# EAGLE schematic Communication_Plug_USB_Micro_B_FCI_10103594-0001LF (EAGLE 6.5.0)
Micro B USB receptacle: FCI 10103594-0001LF Datasheet <http://portal.fciconnect.com/Comergent//fci/drawing/10103594.pdf> Through hole As per USB spec, the capacitance across the USB power lines must be between 1µf and 10µf. Use 5V_USB service and a load limiter like the FPF2123 if your board does not meet this specification or if you are unsure.
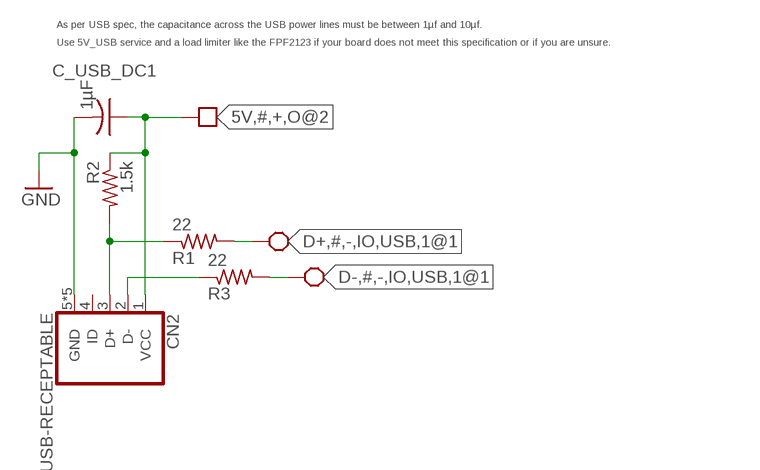
[diagram p0: schematic, sheet 1]

## Parts
C_USB_DC1  1µF  C-USC0603  [C0603]
CN2  USB-RECEPTABLE  [FCI-10103594-0001LF]
R1  22  R-US_R0603  [R0603]
R2  1.5k  R-US_R0603  [R0603]
R3  22  R-US_R0603  [R0603]

## Nets
5V,#,+,O@2: C_USB_DC1.1 CN2.1(VCC) R2.1 ; supply symbol labelled BLOCK_OPTIONAL
D+,#,-,IO,USB,1@1: R1.2 ; supply symbol labelled BLOCK_REQUIREMENT
D+_IN_1: CN2.3(D+) R1.1 R2.2
D-,#,-,IO,USB,1@1: R3.2 ; supply symbol labelled BLOCK_REQUIREMENT
D-_IN_1: CN2.2(D-) R3.1
GND: C_USB_DC1.2 CN2.5(GND) CN2.P$1(GND) CN2.P$2(GND) CN2.P$3(GND) CN2.P$4(GND)
Unconnected: CN2.4(ID)

## Notes on the sheet
- As per USB spec, the capacitance across the USB power lines must be between 1µf and 10µf.
- Use 5V_USB service and a load limiter like the FPF2123 if your board does not meet this specification or if you are unsure.

## Library data of the parts
C_USB_DC1 = resistor:C-US: CAPACITOR, American symbol
CN2 = neels:USB-RECEPTABLE: USB Receptable
R1-R3 = resistor:R-US_: RESISTOR, American symbol